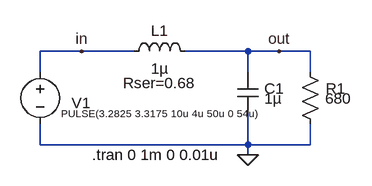
[diagram p0: schematic gps-3.3v-decoupling.asc]
gps-3.3v-decoupling.asc, the LTspice schematic file:
Version 4
SHEET 1 880 680
WIRE 32 96 -32 96
WIRE 112 96 32 96
WIRE 288 96 192 96
WIRE 336 96 288 96
WIRE 384 96 336 96
WIRE -32 128 -32 96
WIRE 288 128 288 96
WIRE 384 128 384 96
WIRE -32 240 -32 208
WIRE 288 240 288 192
WIRE 288 240 -32 240
WIRE 384 240 384 208
WIRE 384 240 288 240
WIRE 288 256 288 240
FLAG 288 256 0
FLAG 32 96 in
FLAG 336 96 out
SYMBOL ind 96 112 R270
WINDOW 0 32 56 VTop 2
WINDOW 3 5 56 VBottom 2
WINDOW 39 -17 56 VBottom 2
SYMATTR InstName L1
SYMATTR Value 1µ
SYMATTR SpiceLine Rser=0.68
SYMBOL cap 272 128 R0
WINDOW 0 41 25 Left 2
WINDOW 3 41 41 Left 2
SYMATTR InstName C1
SYMATTR Value 1µ
SYMATTR SpiceLine Rser=0.02
SYMBOL res 368 112 R0
WINDOW 0 40 41 Left 2
WINDOW 3 39 57 Left 2
SYMATTR InstName R1
SYMATTR Value 680
SYMBOL voltage -32 112 R0
WINDOW 3 32 80 Left 1
WINDOW 123 0 0 Left 0
WINDOW 39 0 0 Left 0
WINDOW 0 48 64 Left 2
SYMATTR Value PULSE(3.2825 3.3175 10u 4u 50u 0 54u)
SYMATTR InstName V1
TEXT 48 256 Left 2 !.tran 0 1m 0 0.01u

The netlist it stands for:
* gps-3.3v-decoupling.asc
L1 in out 1µ Rser=0.68
C1 out 0 1µ Rser=0.02
R1 out 0 680
V1 in 0 PULSE(3.2825 3.3175 10u 4u 50u 0 54u)
.tran 0 1m 0 0.01u
.backanno
.end